# Altium schematic sheet Power Regulator.SchDoc
size A4; SheetNumber: 2; SheetTotal: 9
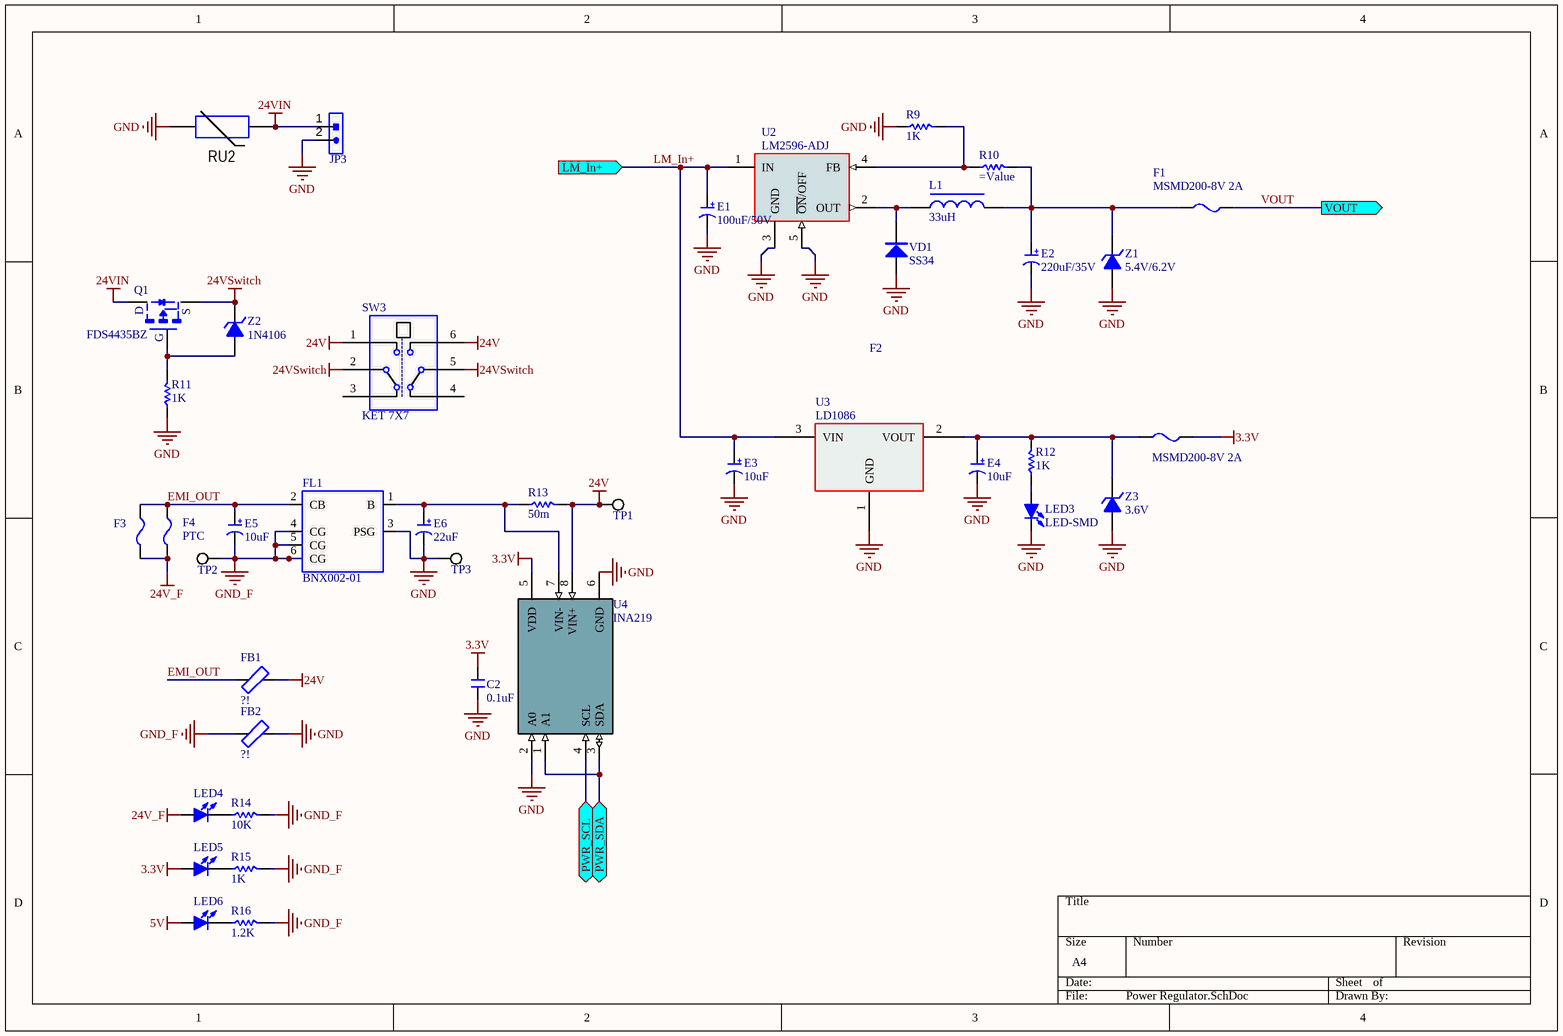
[diagram p0: Power Regulator.SchDoc]

## Parts
C2  0.1uF  [C 0805]
E1  100uF/50V  [CM C(5*5.4)]
E2  220uF/35V  [CM C(5*5.4)]
E3  10uF  [CM C(5*5.4)]
E4  10uF  [CM C(5*5.4)]
E5  10uF  [CM D(6.3*7.7)]
E6  22uF  [CM D(6.3*7.7)]
F1  MSMD200-8V 2A  [FU 0805]
F2  MSMD200-8V 2A  [FU 0805]
F3  MSMD200-8V 2A  [FU 1206]  (value not drawn)
F4  PTC  [PTC]
FB1  ?!  [F 1206]
FB2  ?!  [F 1206]
FL1  BNX002-01  [FIL_BNX002-01]
JP3  HDR-1X2  [KF2EDGK-2P_H_7.62]  (value not drawn)
L1  33uH  [CD53]
LED3  LED-SMD  [LED 0805R]
LED4  LED-SMD  [LED 0805R]  (value not drawn)
LED5  LED-SMD  [LED 0805R]  (value not drawn)
LED6  LED-SMD  [LED 0805R]  (value not drawn)
Q1  FDS4435BZ  [SOP8-E3]
R9  1K  [R 0805]
R10  (no value)  [R 0805]
R11  1K  [R 0805]
R12  1K  [R 0805]
R13  50m  [R 1812]
R14  10K  [R 0805]
R15  1K  [R 0805]
R16  1.2K  [R 0805]
RU2  *  [Varistor Short Hieght - Straight]  (value not drawn)
SW3  KET 7X7  [KFT DIP-7X7]
TP1  Test Point Pad  [TP15]  (value not drawn)
TP2  Test Point Pad  [TP15]  (value not drawn)
TP3  Test Point Pad  [TP15]  (value not drawn)
U2  LM2596-ADJ  [TO263-5A]
U3  LD1086  [TO252]
U4  INA219  [SOT23-8]
VD1  SS34  [SMA]
Z1  5.4V/6.2V  [DO-213AA]
Z2  1N4106  [DO-213AA]
Z3  3.6V  [DO-213AA]

## Ports
LM_In+ (in), PWR_SCL (bidir), PWR_SDA (bidir), VOUT (out)

## Nets
3.3V: C2.2 F2.2 LED5.1(A) U4.5(VDD)
5V: LED6.1(A)
24V: FB1.2 R13.2 SW3.1 SW3.6 TP1.1 U4.8(VIN+)
24V_F: F3.1 F4.1 LED4.1(A)
24VIN: JP3.1 Q1.5-8(D) RU2.2
24VSwitch: Q1.1-3(S) SW3.2 SW3.5 Z2.2(K)
GND: C2.1 E1.2(K) E2.2(K) E3.2(K) E4.2(K) E6.2(K) FB2.2 FL1.3(PSG) JP3.2 LED3.2(K) R9.1 R11.1 RU2.1 TP3.1 U2.3(GND) U2.5(~{ON}/OFF) U3.1(GND) U4.2(A0) U4.6(GND) VD1.1(A) Z1.1(A) Z3.1(A)
GND_F: E5.2(K) FB2.1 FL1.4(CG) FL1.5(CG) FL1.6(CG) R14.2 R15.2 R16.2 TP2.1
EMI_OUT: E5.1(A) F3.2 F4.2 FB1.1 FL1.2(CB)
LM_In+: E1.1(A) E3.1(A) U2.1(IN) U3.3(VIN) ; port LM_In+
PWR_SCL: U4.4(SCL) ; port PWR_SCL
PWR_SDA: U4.1(A1) U4.3(SDA) ; port PWR_SDA
VOUT: F1.2 ; port VOUT
NetE2_1: E2.1(A) F1.1 L1.2 R10.2 Z1.2(K)
NetE4_1: E4.1(A) F2.1 R12.2 U3.2(VOUT) Z3.2(K)
NetE6_1: E6.1(A) FL1.1(B) R13.1 U4.7(VIN-)
NetL1_1: L1.1 U2.2(OUT) VD1.2(K)
NetLED3_1: LED3.1(A) R12.1
NetLED4_2: LED4.2(K) R14.1
NetLED5_2: LED5.2(K) R15.1
NetLED6_2: LED6.2(K) R16.1
NetQ1_4: Q1.4(G) R11.2 Z2.1(A)
NetR9_2: R9.2 R10.1 U2.4(FB)

Not connected (* = marked no-connect by the designer): SW3 3 4

## Notes on the sheet
- (in symbol C-CM) +
- (in symbol KET 7X7) ---------------

## Library data of the parts
C2 = C: Non-polar patch capacitor; BOM名称: 无极性贴片电容; 版权归属: 源创客; 学习资源: www.ooocke.com
E1-E6 = C-CM: Chip electrolytic capacitor; BOM名称: 贴片电解电容; 版权归属: 源创客; 学习资源: www.ooocke.com
F1-F3 = FU: Chip fuse; BOM名称: 贴片保险丝; 版权归属: 源创客; 学习资源: www.ooocke.com
FB1 FB2 = FB: Ferrite Bead; BOM名称: 贴片电阻; 版权归属: 源创客; 学习资源: www.ooocke.com
FL1 = BNX002-01: LC EMI Filter 5th Order Low Pass 2 Channel 10A Block, 4 Lead; MF: Murata; Package: Block-4 Murata; Price: None; SnapEDA_Link: https://www.snapeda.com/parts/BNX002-01/Murata%20Electronics%20North%20America/view-part/12269/?ref=snap; Availability: Unavailable; Value: *; MP: BNX002-01
JP3 = Header 2: 2P Connector; BOM名称: 2P接插件; 版权归属: 源创客; 学习资源: www.ooocke.com
L1 = L-CD: Chip power inductor; BOM名称: 功率电感; 版权归属: 源创客; 学习资源: www.ooocke.com
LED3-LED6 = LED-SMD: Patch LED; BOM名称: 贴片LED; 版权归属: 源创客; 学习资源: www.ooocke.com
R9-R16 = R: Chip resistor; 版权归属: 源创客; BOM名称: Chip resistor; 学习资源: www.ooocke.com
RU2 = V: Versiror; Manufacturer: *; Model: *; HelpURL: *; ComponentKind: *; Value: *
SW3 = KET 7X7: 7*7 switch; BOM名称: 7*7开关; 版权归属: 源创客; 学习资源: www.ooocke.com
TP1-TP3 = Test Point Pad: Company: SJ Libraries; Designer: Eng. Saeid Jorablo; Rule: UNIONINDEX=0|RULEKIND=ComponentClearance|NETSCOPE=AnyNet|LAYERKIND=SameLayer|NAME=Schematic Component Clearance Constraint|GAP=0mil|COLLISIONCHECKMODE=3|VERTICALGAP=0mil|SHOWDISTANCES=FALSE|UNIT=Imperial; Mounting Technology: Surface Mount\Through-Hole; ComponentLink1Description: Datasheet; Pin Count: 0; Update Date: 6/3/2012; Category: MISC; HelpURL: http://s3.picofile.com/file/7443264187/Coming_Soon_logo.gif
U2 = LM2596: DC step-down chip; BOM名称: DC稳压芯片; 版权归属: 源创客; 学习资源: www.ooocke.com
U3 = LD1086: Linear Voltage Regulator IC 1 Output 1.5A DPAK
VD1 = SS34: Schottky diodes; BOM名称: 肖特基二极管; 版权归属: 源创客; 属性: 40V/3A; 学习资源: www.ooocke.com
Z1-Z3 = 1N4106: 12V/0.5W voltage regulator; BOM名称: 12V/0.5W稳压管; 版权归属: 源创客; 学习资源: www.ooocke.com